# EAGLE schematic SP-PC copy (EAGLE 7.6.0)

## Sheet 1 of 2
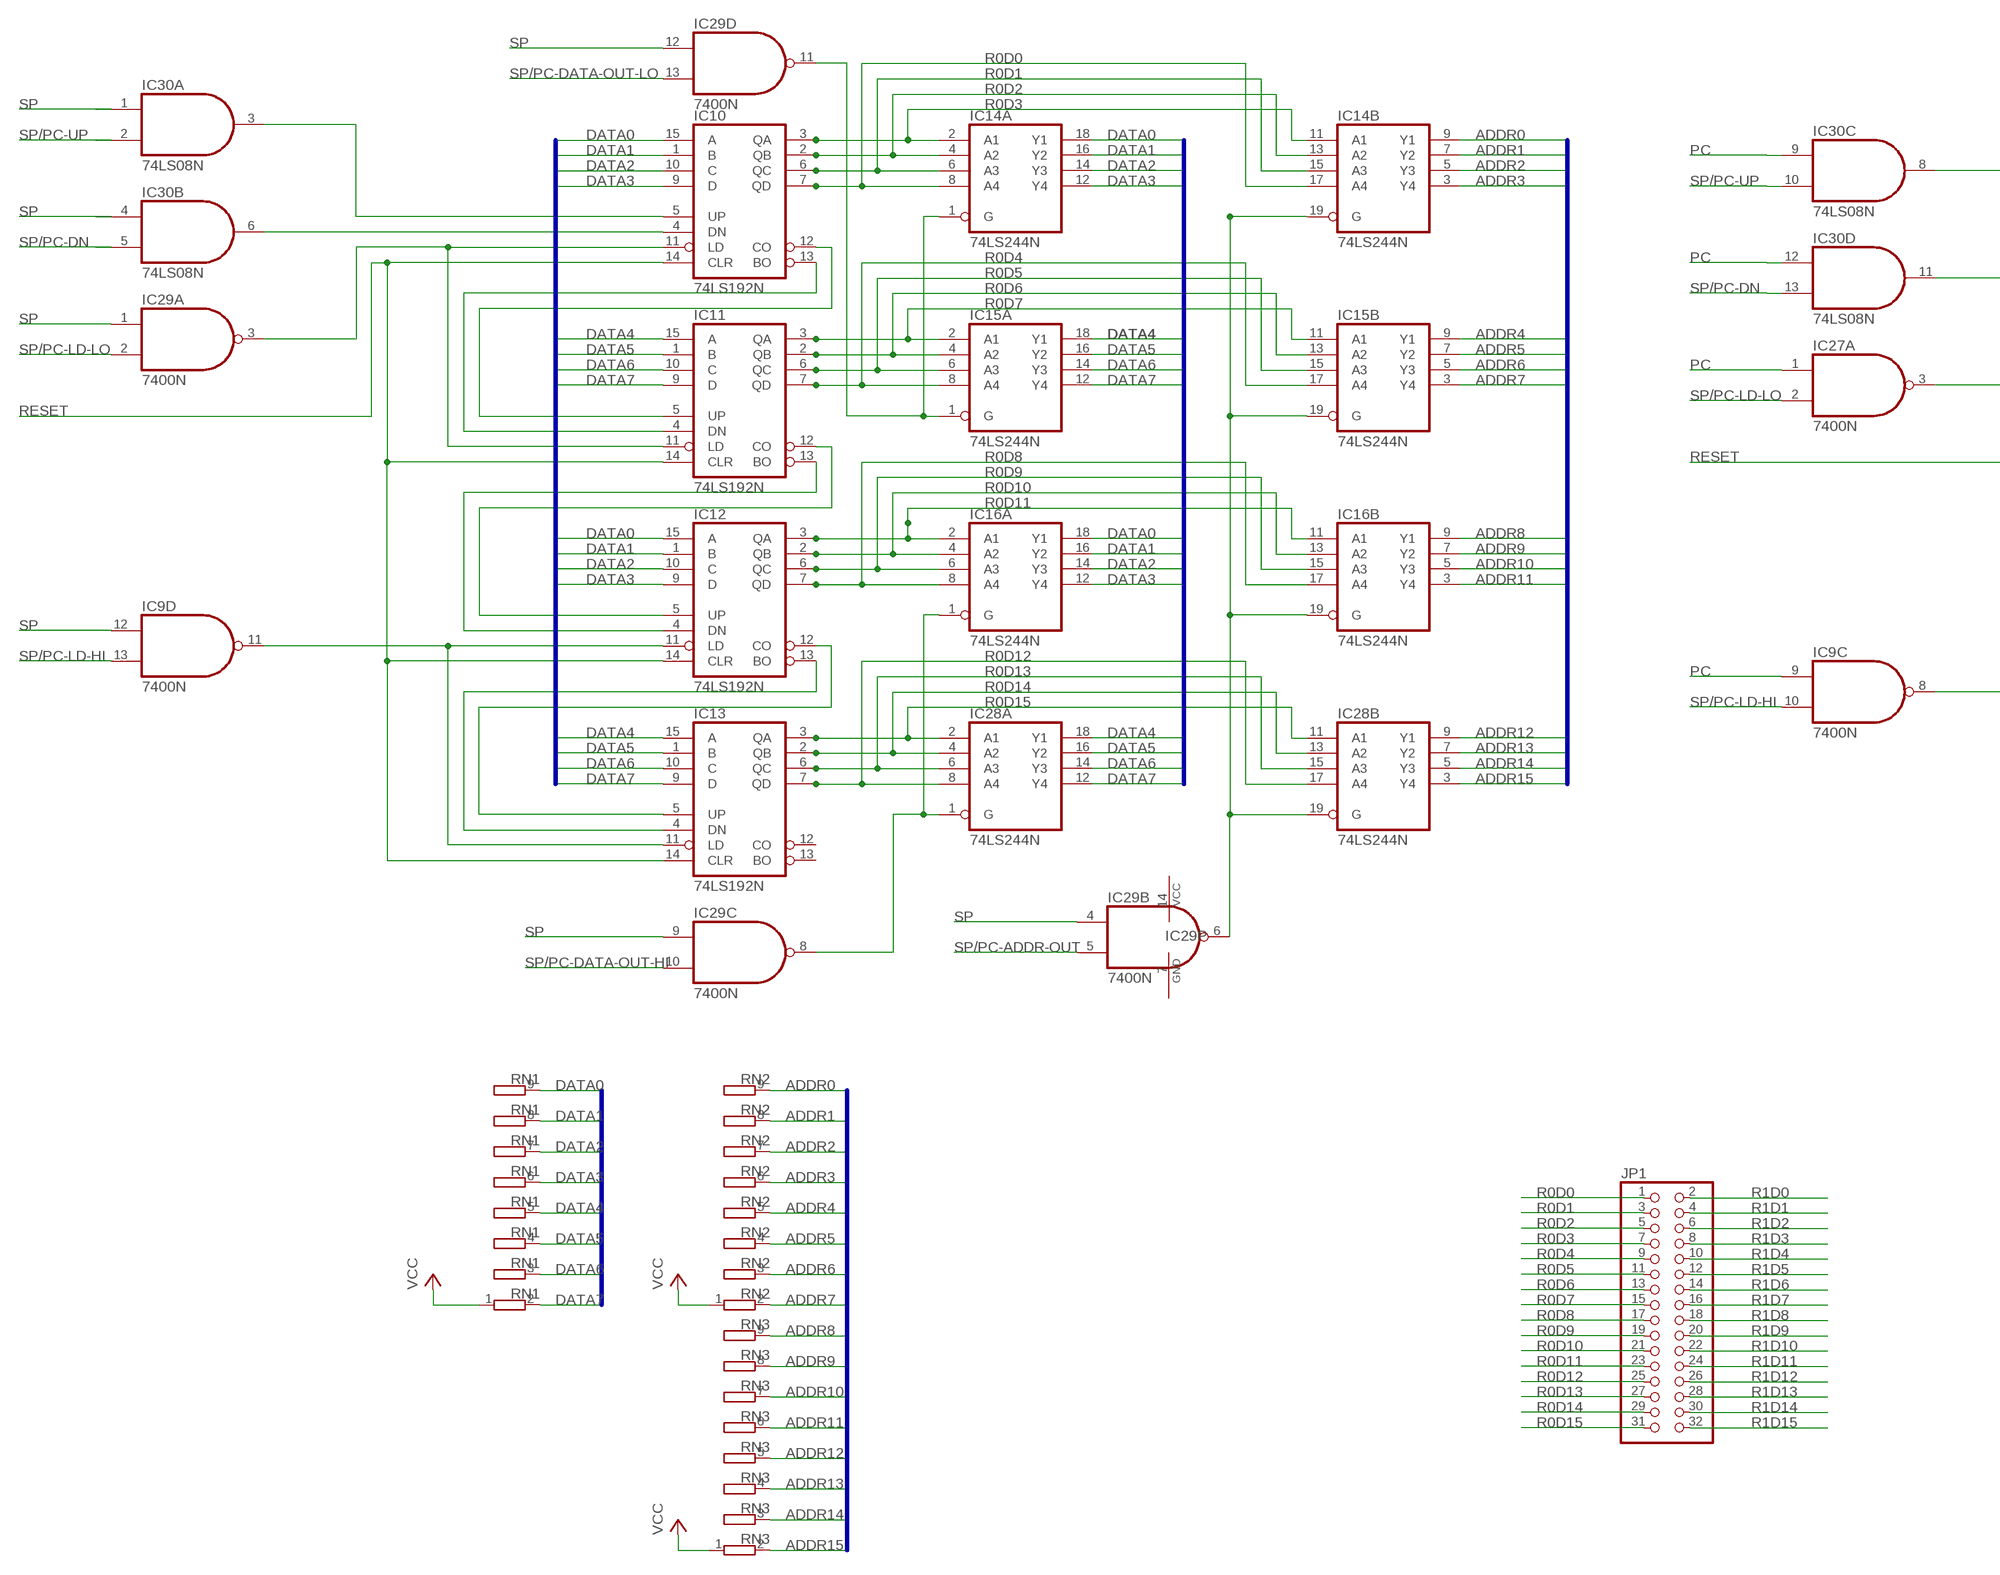
[diagram p0: schematic, sheet 1, part 1 of 2]
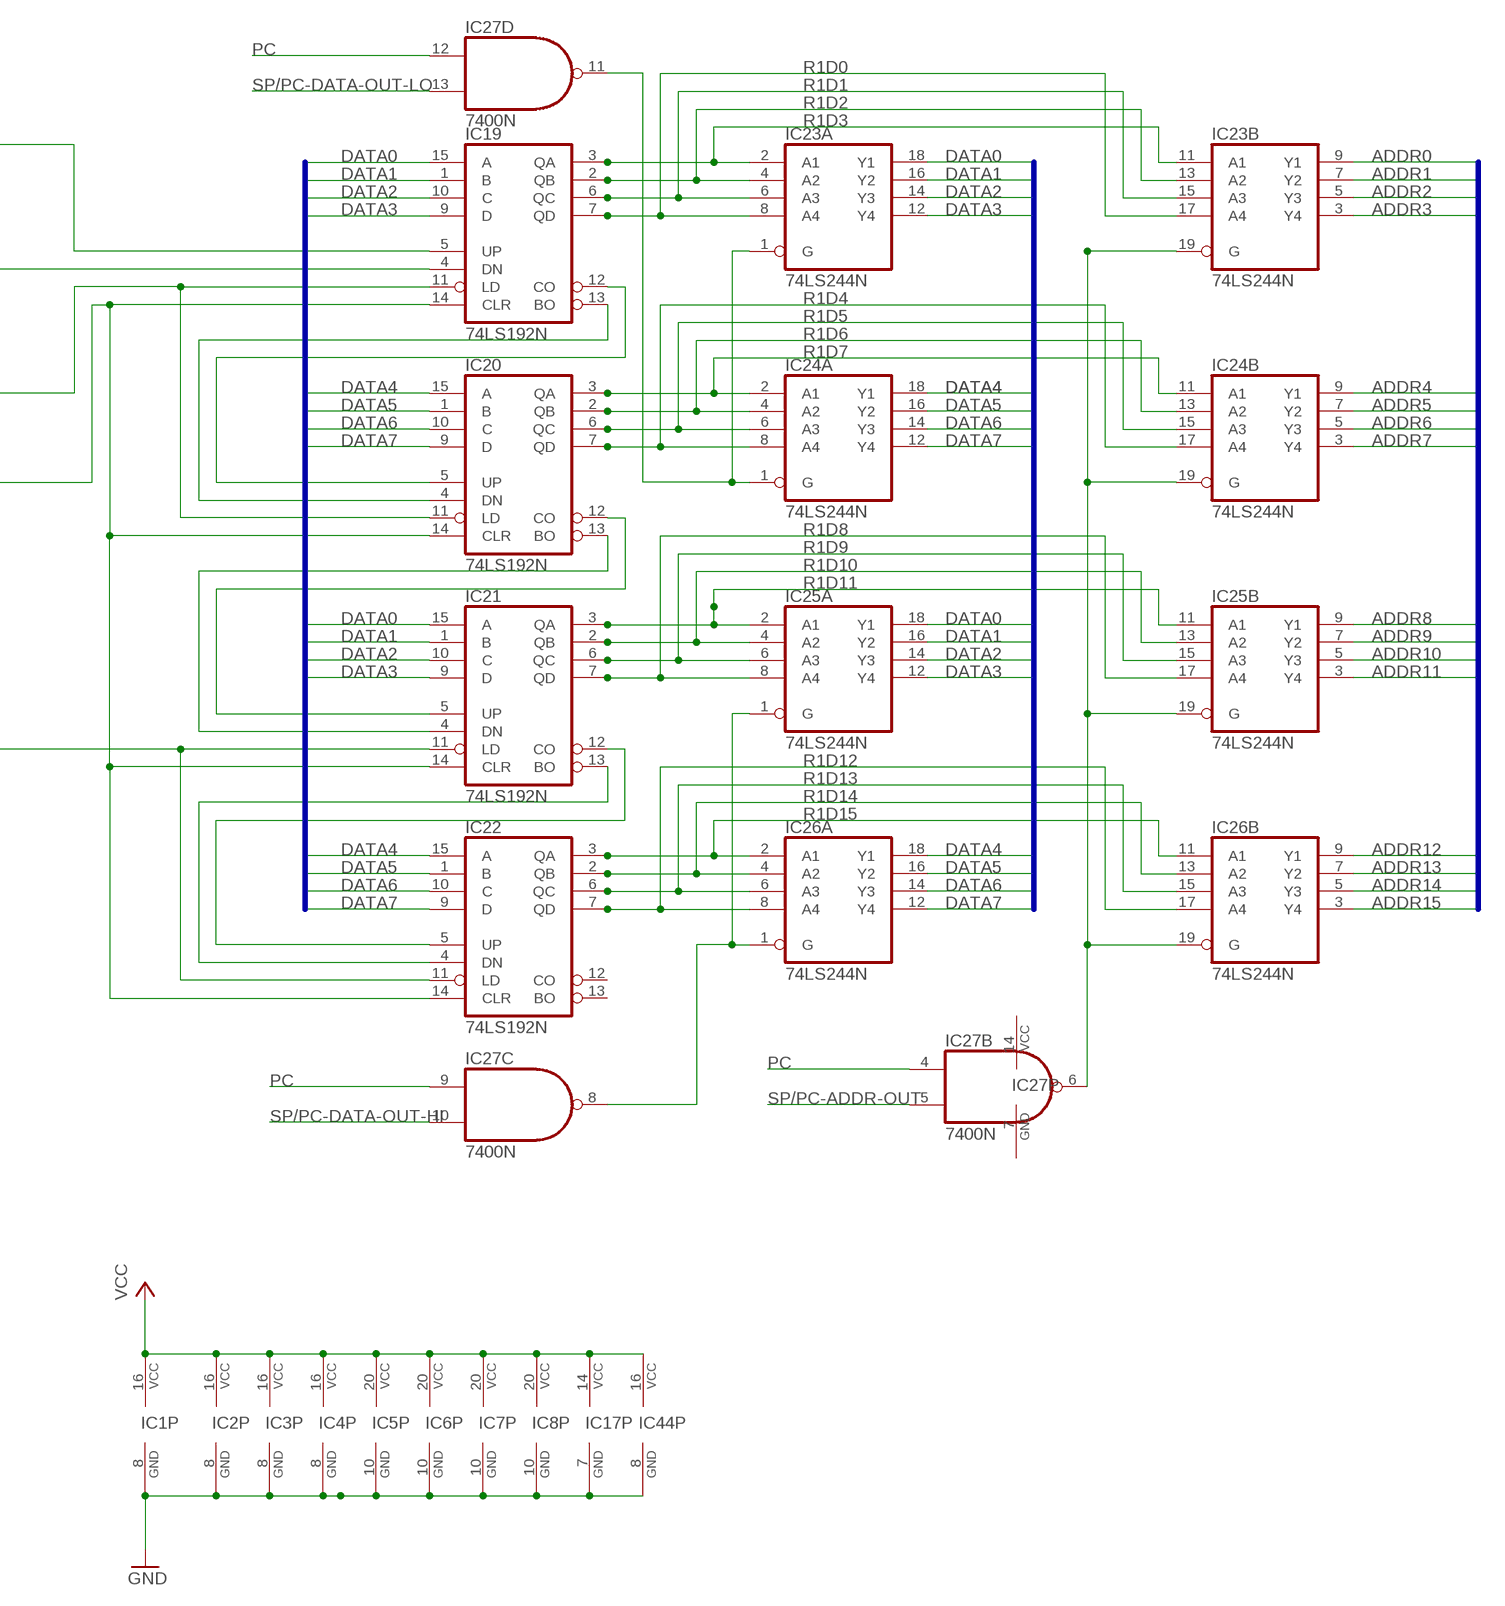
[diagram p1: schematic, sheet 1, part 2 of 2]

### Parts
IC1  74LS192N  [DIL16]
IC2  74LS192N  [DIL16]
IC3  74LS192N  [DIL16]
IC4  74LS192N  [DIL16]
IC5  74LS244N  [DIL20]
IC6  74LS244N  [DIL20]
IC7  74LS244N  [DIL20]
IC8  74LS244N  [DIL20]
IC9  7400N  [DIL14]
IC10  74LS192N  [DIL16]
IC11  74LS192N  [DIL16]
IC12  74LS192N  [DIL16]
IC13  74LS192N  [DIL16]
IC14  74LS244N  [DIL20]
IC15  74LS244N  [DIL20]
IC16  74LS244N  [DIL20]
IC17  7400N  [DIL14]
IC19  74LS192N  [DIL16]
IC20  74LS192N  [DIL16]
IC21  74LS192N  [DIL16]
IC22  74LS192N  [DIL16]
IC23  74LS244N  [DIL20]
IC24  74LS244N  [DIL20]
IC25  74LS244N  [DIL20]
IC26  74LS244N  [DIL20]
IC27  7400N  [DIL14]
IC28  74LS244N  [DIL20]
IC29  7400N  [DIL14]
IC30  74LS08N  [DIL14]
IC44  74LS139N  [DIL16]
JP1  PINHD-2X16  [2X16]
RN1  GE08RP  [SIL9]
RN2  GE08RP  [SIL9]
RN3  GE08RP  [SIL9]

### Nets
ADDR0: IC14.9(B:Y1) IC23.9(B:Y1) RN2.9 ; also sheet 2
ADDR1: IC14.7(B:Y2) IC23.7(B:Y2) RN2.8 ; also sheet 2
ADDR2: IC14.5(B:Y3) IC23.5(B:Y3) RN2.7 ; also sheet 2
ADDR3: IC14.3(B:Y4) IC23.3(B:Y4) RN2.6 ; also sheet 2
ADDR4: IC15.9(B:Y1) IC24.9(B:Y1) RN2.5 ; also sheet 2
ADDR5: IC15.7(B:Y2) IC24.7(B:Y2) RN2.4 ; also sheet 2
ADDR6: IC15.5(B:Y3) IC24.5(B:Y3) RN2.3 ; also sheet 2
ADDR7: IC15.3(B:Y4) IC24.3(B:Y4) RN2.2 ; also sheet 2
ADDR8: IC16.9(B:Y1) IC25.9(B:Y1) RN3.9 ; also sheet 2
ADDR9: IC16.7(B:Y2) IC25.7(B:Y2) RN3.8 ; also sheet 2
ADDR10: IC16.5(B:Y3) IC25.5(B:Y3) RN3.7 ; also sheet 2
ADDR11: IC16.3(B:Y4) IC25.3(B:Y4) RN3.6 ; also sheet 2
ADDR12: IC26.9(B:Y1) IC28.9(B:Y1) RN3.5 ; also sheet 2
ADDR13: IC26.7(B:Y2) IC28.7(B:Y2) RN3.4 ; also sheet 2
ADDR14: IC26.5(B:Y3) IC28.5(B:Y3) RN3.3 ; also sheet 2
ADDR15: IC26.3(B:Y4) IC28.3(B:Y4) RN3.2 ; also sheet 2
DATA0: IC10.15(A) IC12.15(A) IC14.18(A:Y1) IC16.18(A:Y1) IC19.15(A) IC21.15(A) IC23.18(A:Y1) IC25.18(A:Y1) RN1.9 ; also sheet 2
DATA1: IC10.1(B) IC12.1(B) IC14.16(A:Y2) IC16.16(A:Y2) IC19.1(B) IC21.1(B) IC23.16(A:Y2) IC25.16(A:Y2) RN1.8 ; also sheet 2
DATA2: IC10.10(C) IC12.10(C) IC14.14(A:Y3) IC16.14(A:Y3) IC19.10(C) IC21.10(C) IC23.14(A:Y3) IC25.14(A:Y3) RN1.7 ; also sheet 2
DATA3: IC10.9(D) IC12.9(D) IC14.12(A:Y4) IC16.12(A:Y4) IC19.9(D) IC21.9(D) IC23.12(A:Y4) IC25.12(A:Y4) RN1.6 ; also sheet 2
DATA4: IC11.15(A) IC13.15(A) IC15.18(A:Y1) IC20.15(A) IC22.15(A) IC24.18(A:Y1) IC26.18(A:Y1) IC28.18(A:Y1) RN1.5 ; also sheet 2
DATA5: IC11.1(B) IC13.1(B) IC15.16(A:Y2) IC20.1(B) IC22.1(B) IC24.16(A:Y2) IC26.16(A:Y2) IC28.16(A:Y2) RN1.4 ; also sheet 2
DATA6: IC11.10(C) IC13.10(C) IC15.14(A:Y3) IC20.10(C) IC22.10(C) IC24.14(A:Y3) IC26.14(A:Y3) IC28.14(A:Y3) RN1.3 ; also sheet 2
DATA7: IC11.9(D) IC13.9(D) IC15.12(A:Y4) IC20.9(D) IC22.9(D) IC24.12(A:Y4) IC26.12(A:Y4) IC28.12(A:Y4) RN1.2 ; also sheet 2
GND: IC1.8(GND) IC2.8(GND) IC3.8(GND) IC4.8(GND) IC5.10(P:GND) IC6.10(P:GND) IC7.10(P:GND) IC8.10(P:GND) IC17.7(P:GND) IC44.8(P:GND) ; also sheet 2
N$10: IC10.13(BO) IC11.4(DN)
N$11: IC10.12(CO) IC11.5(UP)
N$12: IC11.13(BO) IC12.4(DN)
N$13: IC11.12(CO) IC12.5(UP)
N$14: IC12.13(BO) IC13.4(DN)
N$15: IC12.12(CO) IC13.5(UP)
N$16: IC10.11(LD) IC11.11(LD) IC29.3(A:O)
N$17: IC10.5(UP) IC30.3(A:O)
N$18: IC10.4(DN) IC30.6(B:O)
N$19: IC14.19(B:G) IC15.19(B:G) IC16.19(B:G) IC28.19(B:G) IC29.6(B:O)
N$20: IC14.1(A:G) IC15.1(A:G) IC29.11(D:O)
N$21: IC16.1(A:G) IC28.1(A:G) IC29.8(C:O)
N$22: IC9.11(D:O) IC12.11(LD) IC13.11(LD)
N$58: IC19.13(BO) IC20.4(DN)
N$59: IC19.12(CO) IC20.5(UP)
N$60: IC20.13(BO) IC21.4(DN)
N$61: IC20.12(CO) IC21.5(UP)
N$62: IC21.13(BO) IC22.4(DN)
N$63: IC21.12(CO) IC22.5(UP)
N$64: IC19.11(LD) IC20.11(LD) IC27.3(A:O)
N$65: IC19.5(UP) IC30.8(C:O)
N$66: IC19.4(DN) IC30.11(D:O)
N$83: IC23.19(B:G) IC24.19(B:G) IC25.19(B:G) IC26.19(B:G) IC27.6(B:O)
N$84: IC23.1(A:G) IC24.1(A:G) IC27.11(D:O)
N$85: IC25.1(A:G) IC26.1(A:G) IC27.8(C:O)
N$86: IC9.8(C:O) IC21.11(LD) IC22.11(LD)
PC: IC9.9(C:I0) IC27.1(A:I0) IC27.4(B:I0) IC27.9(C:I0) IC27.12(D:I0) IC30.9(C:I0) IC30.12(D:I0)
R0D0: IC10.7(QD) IC14.8(A:A4) IC14.17(B:A4) JP1.1
R0D1: IC10.6(QC) IC14.6(A:A3) IC14.15(B:A3) JP1.3
R0D2: IC10.2(QB) IC14.4(A:A2) IC14.13(B:A2) JP1.5
R0D3: IC10.3(QA) IC14.2(A:A1) IC14.11(B:A1) JP1.7
R0D4: IC11.7(QD) IC15.8(A:A4) IC15.17(B:A4) JP1.9
R0D5: IC11.6(QC) IC15.6(A:A3) IC15.15(B:A3) JP1.11
R0D6: IC11.2(QB) IC15.4(A:A2) IC15.13(B:A2) JP1.13
R0D7: IC11.3(QA) IC15.2(A:A1) IC15.11(B:A1) JP1.15
R0D8: IC12.7(QD) IC16.8(A:A4) IC16.17(B:A4) JP1.17
R0D9: IC12.6(QC) IC16.6(A:A3) IC16.15(B:A3) JP1.19
R0D10: IC12.2(QB) IC16.4(A:A2) IC16.13(B:A2) JP1.21
R0D11: IC12.3(QA) IC16.2(A:A1) IC16.11(B:A1) JP1.23
R0D12: IC13.7(QD) IC28.8(A:A4) IC28.17(B:A4) JP1.25
R0D13: IC13.6(QC) IC28.6(A:A3) IC28.15(B:A3) JP1.27
R0D14: IC13.2(QB) IC28.4(A:A2) IC28.13(B:A2) JP1.29
R0D15: IC13.3(QA) IC28.2(A:A1) IC28.11(B:A1) JP1.31
R1D0: IC19.7(QD) IC23.8(A:A4) IC23.17(B:A4) JP1.2
R1D1: IC19.6(QC) IC23.6(A:A3) IC23.15(B:A3) JP1.4
R1D2: IC19.2(QB) IC23.4(A:A2) IC23.13(B:A2) JP1.6
R1D3: IC19.3(QA) IC23.2(A:A1) IC23.11(B:A1) JP1.8
R1D4: IC20.7(QD) IC24.8(A:A4) IC24.17(B:A4) JP1.10
R1D5: IC20.6(QC) IC24.6(A:A3) IC24.15(B:A3) JP1.12
R1D6: IC20.2(QB) IC24.4(A:A2) IC24.13(B:A2) JP1.14
R1D7: IC20.3(QA) IC24.2(A:A1) IC24.11(B:A1) JP1.16
R1D8: IC21.7(QD) IC25.8(A:A4) IC25.17(B:A4) JP1.18
R1D9: IC21.6(QC) IC25.6(A:A3) IC25.15(B:A3) JP1.20
R1D10: IC21.2(QB) IC25.4(A:A2) IC25.13(B:A2) JP1.22
R1D11: IC21.3(QA) IC25.2(A:A1) IC25.11(B:A1) JP1.24
R1D12: IC22.7(QD) IC26.8(A:A4) IC26.17(B:A4) JP1.26
R1D13: IC22.6(QC) IC26.6(A:A3) IC26.15(B:A3) JP1.28
R1D14: IC22.2(QB) IC26.4(A:A2) IC26.13(B:A2) JP1.30
R1D15: IC22.3(QA) IC26.2(A:A1) IC26.11(B:A1) JP1.32
RESET: IC10.14(CLR) IC11.14(CLR) IC12.14(CLR) IC13.14(CLR) IC19.14(CLR) IC20.14(CLR) IC21.14(CLR) IC22.14(CLR) ; also sheet 2
SP: IC9.12(D:I0) IC29.1(A:I0) IC29.4(B:I0) IC29.9(C:I0) IC29.12(D:I0) IC30.1(A:I0) IC30.4(B:I0)
SP/PC-ADDR-OUT: IC27.5(B:I1) IC29.5(B:I1) ; also sheet 2
SP/PC-DATA-OUT-HI: IC27.10(C:I1) IC29.10(C:I1)
SP/PC-DATA-OUT-LO: IC27.13(D:I1) IC29.13(D:I1)
SP/PC-DN: IC30.5(B:I1) IC30.13(D:I1) ; also sheet 2
SP/PC-LD-HI: IC9.10(C:I1) IC9.13(D:I1) ; also sheet 2
SP/PC-LD-LO: IC27.2(A:I1) IC29.2(A:I1) ; also sheet 2
SP/PC-UP: IC30.2(A:I1) IC30.10(C:I1) ; also sheet 2
VCC: IC1.16(VCC) IC2.16(VCC) IC3.16(VCC) IC4.16(VCC) IC5.20(P:VCC) IC6.20(P:VCC) IC7.20(P:VCC) IC8.20(P:VCC) IC17.14(P:VCC) IC44.16(P:VCC) RN1.1 RN2.1 RN3.1 ; also sheet 2
Unconnected: IC1.1(B) IC1.2(QB) IC1.3(QA) IC1.4(DN) IC1.5(UP) IC1.6(QC) IC1.7(QD) IC1.9(D) IC1.10(C) IC1.11(LD) IC1.12(CO) IC1.13(BO) IC1.14(CLR) IC1.15(A) IC2.1(B) IC2.2(QB) IC2.3(QA) IC2.4(DN) IC2.5(UP) IC2.6(QC) IC2.7(QD) IC2.9(D) IC2.10(C) IC2.11(LD) IC2.12(CO) IC2.13(BO) IC2.14(CLR) IC2.15(A) IC3.1(B) IC3.2(QB) IC3.3(QA) IC3.4(DN) IC3.5(UP) IC3.6(QC) IC3.7(QD) IC3.9(D) IC3.10(C) IC3.11(LD) IC3.12(CO) IC3.13(BO) IC3.14(CLR) IC3.15(A) IC4.1(B) IC4.2(QB) IC4.3(QA) IC4.4(DN) IC4.5(UP) IC4.6(QC) IC4.7(QD) IC4.9(D) IC4.10(C) IC4.11(LD) IC4.12(CO) IC4.13(BO) IC4.14(CLR) IC4.15(A) IC5.1(A:G) IC5.2(A:A1) IC5.3(B:Y4) IC5.4(A:A2) IC5.5(B:Y3) IC5.6(A:A3) IC5.7(B:Y2) IC5.8(A:A4) IC5.9(B:Y1) IC5.11(B:A1) IC5.12(A:Y4) IC5.13(B:A2) IC5.14(A:Y3) IC5.15(B:A3) IC5.16(A:Y2) IC5.17(B:A4) IC5.18(A:Y1) IC5.19(B:G) IC6.1(A:G) IC6.2(A:A1) IC6.3(B:Y4) IC6.4(A:A2) IC6.5(B:Y3) IC6.6(A:A3) IC6.7(B:Y2) IC6.8(A:A4) IC6.9(B:Y1) IC6.11(B:A1) IC6.12(A:Y4) IC6.13(B:A2) IC6.14(A:Y3) IC6.15(B:A3) IC6.16(A:Y2) IC6.17(B:A4) IC6.18(A:Y1) IC6.19(B:G) IC7.1(A:G) IC7.2(A:A1) IC7.3(B:Y4) IC7.4(A:A2) IC7.5(B:Y3) IC7.6(A:A3) IC7.7(B:Y2) IC7.8(A:A4) IC7.9(B:Y1) IC7.11(B:A1) IC7.12(A:Y4) IC7.13(B:A2) IC7.14(A:Y3) IC7.15(B:A3) IC7.16(A:Y2) IC7.17(B:A4) IC7.18(A:Y1) IC7.19(B:G) IC8.1(A:G) IC8.2(A:A1) IC8.3(B:Y4) IC8.4(A:A2) IC8.5(B:Y3) IC8.6(A:A3) IC8.7(B:Y2) IC8.8(A:A4) IC8.9(B:Y1) IC8.11(B:A1) IC8.12(A:Y4) IC8.13(B:A2) IC8.14(A:Y3) IC8.15(B:A3) IC8.16(A:Y2) IC8.17(B:A4) IC8.18(A:Y1) IC8.19(B:G) IC9.1(A:I0) IC9.2(A:I1) IC9.3(A:O) IC9.4(B:I0) IC9.5(B:I1) IC9.6(B:O) IC13.12(CO) IC13.13(BO) IC17.1(A:I0) IC17.2(A:I1) IC17.3(A:O) IC17.4(B:I0) IC17.5(B:I1) IC17.6(B:O) IC17.8(C:O) IC17.9(C:I0) IC17.10(C:I1) IC17.11(D:O) IC17.12(D:I0) IC17.13(D:I1) IC22.12(CO) IC22.13(BO) IC44.1(A:G) IC44.2(A:A) IC44.3(A:B) IC44.4(A:Y0) IC44.5(A:Y1) IC44.6(A:Y2) IC44.7(A:Y3) IC44.9(B:Y3) IC44.10(B:Y2) IC44.11(B:Y1) IC44.12(B:Y0) IC44.13(B:B) IC44.14(B:A) IC44.15(B:G)

### Buses
ADDR[0..15]
DATA[0..7]

## Sheet 2 of 2
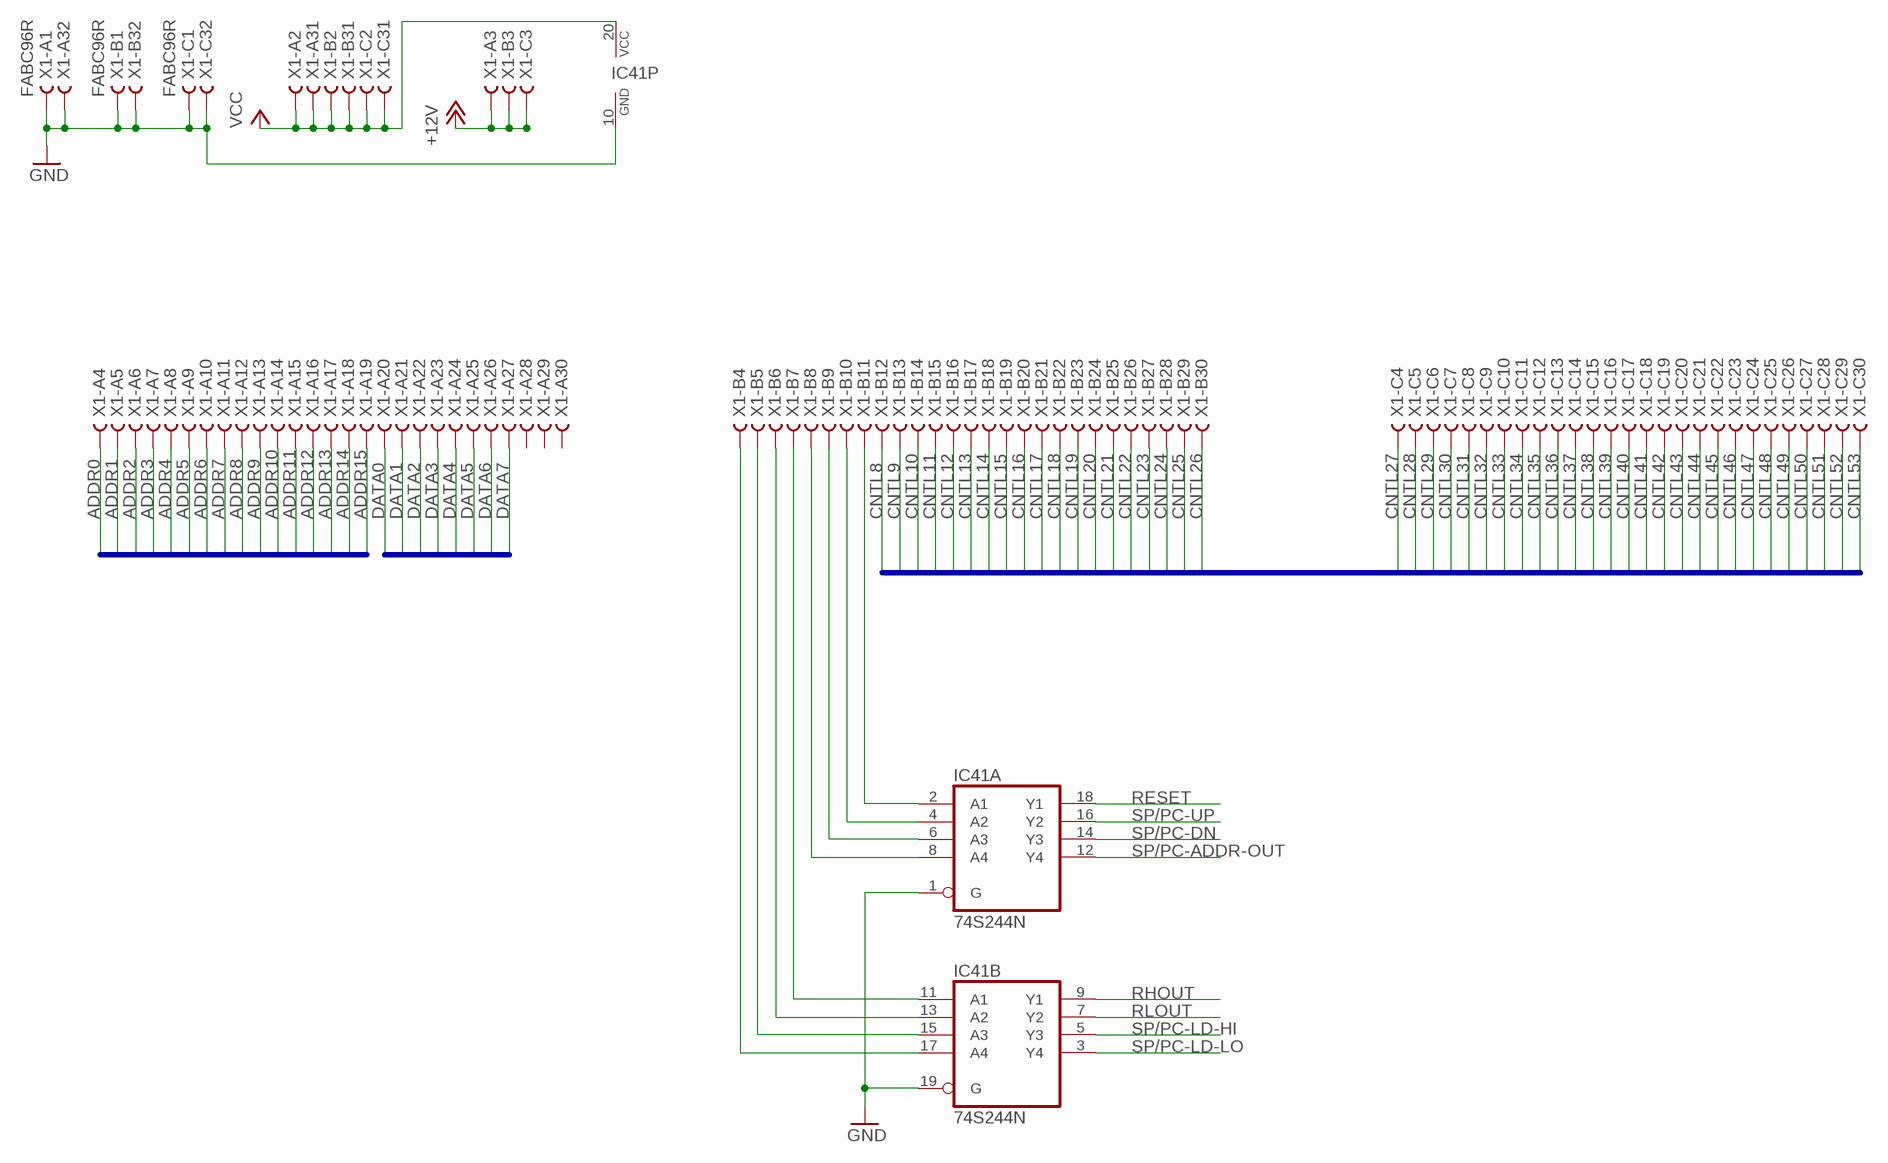
[diagram p2: schematic, sheet 2]

### Parts
IC41  74S244N  [DIL20]
X1  FABC96R  [FABC96R]

### Nets
+12V: X1.A3 X1.B3 X1.C3
ADDR0: X1.A4 ; also sheet 1
ADDR1: X1.A5 ; also sheet 1
ADDR2: X1.A6 ; also sheet 1
ADDR3: X1.A7 ; also sheet 1
ADDR4: X1.A8 ; also sheet 1
ADDR5: X1.A9 ; also sheet 1
ADDR6: X1.A10 ; also sheet 1
ADDR7: X1.A11 ; also sheet 1
ADDR8: X1.A12 ; also sheet 1
ADDR9: X1.A13 ; also sheet 1
ADDR10: X1.A14 ; also sheet 1
ADDR11: X1.A15 ; also sheet 1
ADDR12: X1.A16 ; also sheet 1
ADDR13: X1.A17 ; also sheet 1
ADDR14: X1.A18 ; also sheet 1
ADDR15: X1.A19 ; also sheet 1
CNTL8: X1.B12
CNTL9: X1.B13
CNTL10: X1.B14
CNTL11: X1.B15
CNTL12: X1.B16
CNTL13: X1.B17
CNTL14: X1.B18
CNTL15: X1.B19
CNTL16: X1.B20
CNTL17: X1.B21
CNTL18: X1.B22
CNTL19: X1.B23
CNTL20: X1.B24
CNTL21: X1.B25
CNTL22: X1.B26
CNTL23: X1.B27
CNTL24: X1.B28
CNTL25: X1.B29
CNTL26: X1.B30
CNTL27: X1.C4
CNTL28: X1.C5
CNTL29: X1.C6
CNTL30: X1.C7
CNTL31: X1.C8
CNTL32: X1.C9
CNTL33: X1.C10
CNTL34: X1.C11
CNTL35: X1.C12
CNTL36: X1.C13
CNTL37: X1.C14
CNTL38: X1.C15
CNTL39: X1.C16
CNTL40: X1.C17
CNTL41: X1.C18
CNTL42: X1.C19
CNTL43: X1.C20
CNTL44: X1.C21
CNTL45: X1.C22
CNTL46: X1.C23
CNTL47: X1.C24
CNTL48: X1.C25
CNTL49: X1.C26
CNTL50: X1.C27
CNTL51: X1.C28
CNTL52: X1.C29
CNTL53: X1.C30
DATA0: X1.A20 ; also sheet 1
DATA1: X1.A21 ; also sheet 1
DATA2: X1.A22 ; also sheet 1
DATA3: X1.A23 ; also sheet 1
DATA4: X1.A24 ; also sheet 1
DATA5: X1.A25 ; also sheet 1
DATA6: X1.A26 ; also sheet 1
DATA7: X1.A27 ; also sheet 1
GND: IC41.1(A:G) IC41.10(P:GND) IC41.19(B:G) X1.A1 X1.A32 X1.B1 X1.B32 X1.C1 X1.C32 ; also sheet 1
N$116: IC41.17(B:A4) X1.B4
N$118: IC41.15(B:A3) X1.B5
N$119: IC41.13(B:A2) X1.B6
N$120: IC41.11(B:A1) X1.B7
N$121: IC41.8(A:A4) X1.B8
N$122: IC41.6(A:A3) X1.B9
N$123: IC41.4(A:A2) X1.B10
N$124: IC41.2(A:A1) X1.B11
RESET: IC41.18(A:Y1) ; also sheet 1
RHOUT: IC41.9(B:Y1)
RLOUT: IC41.7(B:Y2)
SP/PC-ADDR-OUT: IC41.12(A:Y4) ; also sheet 1
SP/PC-DN: IC41.14(A:Y3) ; also sheet 1
SP/PC-LD-HI: IC41.5(B:Y3) ; also sheet 1
SP/PC-LD-LO: IC41.3(B:Y4) ; also sheet 1
SP/PC-UP: IC41.16(A:Y2) ; also sheet 1
VCC: IC41.20(P:VCC) X1.A2 X1.A31 X1.B2 X1.B31 X1.C2 X1.C31 ; also sheet 1
Unconnected: X1.A28 X1.A29 X1.A30

### Buses
ADDR[0..15]
DATA[0..7]
CNTL[0..53]

## Power pins joined to a net without a drawn wire
GND: IC9.7(P:GND) IC10.8(GND) IC11.8(GND) IC12.8(GND) IC13.8(GND) IC14.10(P:GND) IC15.10(P:GND) IC16.10(P:GND) IC19.8(GND) IC20.8(GND) IC21.8(GND) IC22.8(GND) IC23.10(P:GND) IC24.10(P:GND) IC25.10(P:GND) IC26.10(P:GND) IC27.7(P:GND) IC28.10(P:GND) IC29.7(P:GND) IC30.7(P:GND)
VCC: IC9.14(P:VCC) IC10.16(VCC) IC11.16(VCC) IC12.16(VCC) IC13.16(VCC) IC14.20(P:VCC) IC15.20(P:VCC) IC16.20(P:VCC) IC19.16(VCC) IC20.16(VCC) IC21.16(VCC) IC22.16(VCC) IC23.20(P:VCC) IC24.20(P:VCC) IC25.20(P:VCC) IC26.20(P:VCC) IC27.14(P:VCC) IC28.20(P:VCC) IC29.14(P:VCC) IC30.14(P:VCC)

## Library data of the parts
IC1-IC4 IC10-IC13 IC19-IC22 = 74xx-us:74*192: Synchronous 4-bit UP/DOWN COUNTER
IC5-IC8 IC14-IC16 IC23-IC26 IC28 = 74xx-us:74*244: Octal BUFFER and LINE DRIVER, 3-state
IC9 IC17 IC27 IC29 = 74xx-us:74*00: Quad 2-input NAND gate
IC30 = 74xx-us:74*08: Quad 2-input AND gate
IC41 = 74xx-eu:74*244: Octal BUFFER and LINE DRIVER, 3-state
IC44 = 74xx-us:74*139: Dual 2-line to 4-line DECODER/DEMULTIPLEXER
JP1 = pinhead:PINHD-2X16: PIN HEADER
RN1-RN3 = resistor-sil:GE08RP: SIL RESISTOR; OC_FARNELL: unknown; OC_NEWARK: unknown
X1 = con-vg:FABC96R: CONNECTOR female, 96 pins, type R, rows ABC, grid 2.54 mm